# EAGLE design board_v2 (EAGLE 9.2.0)
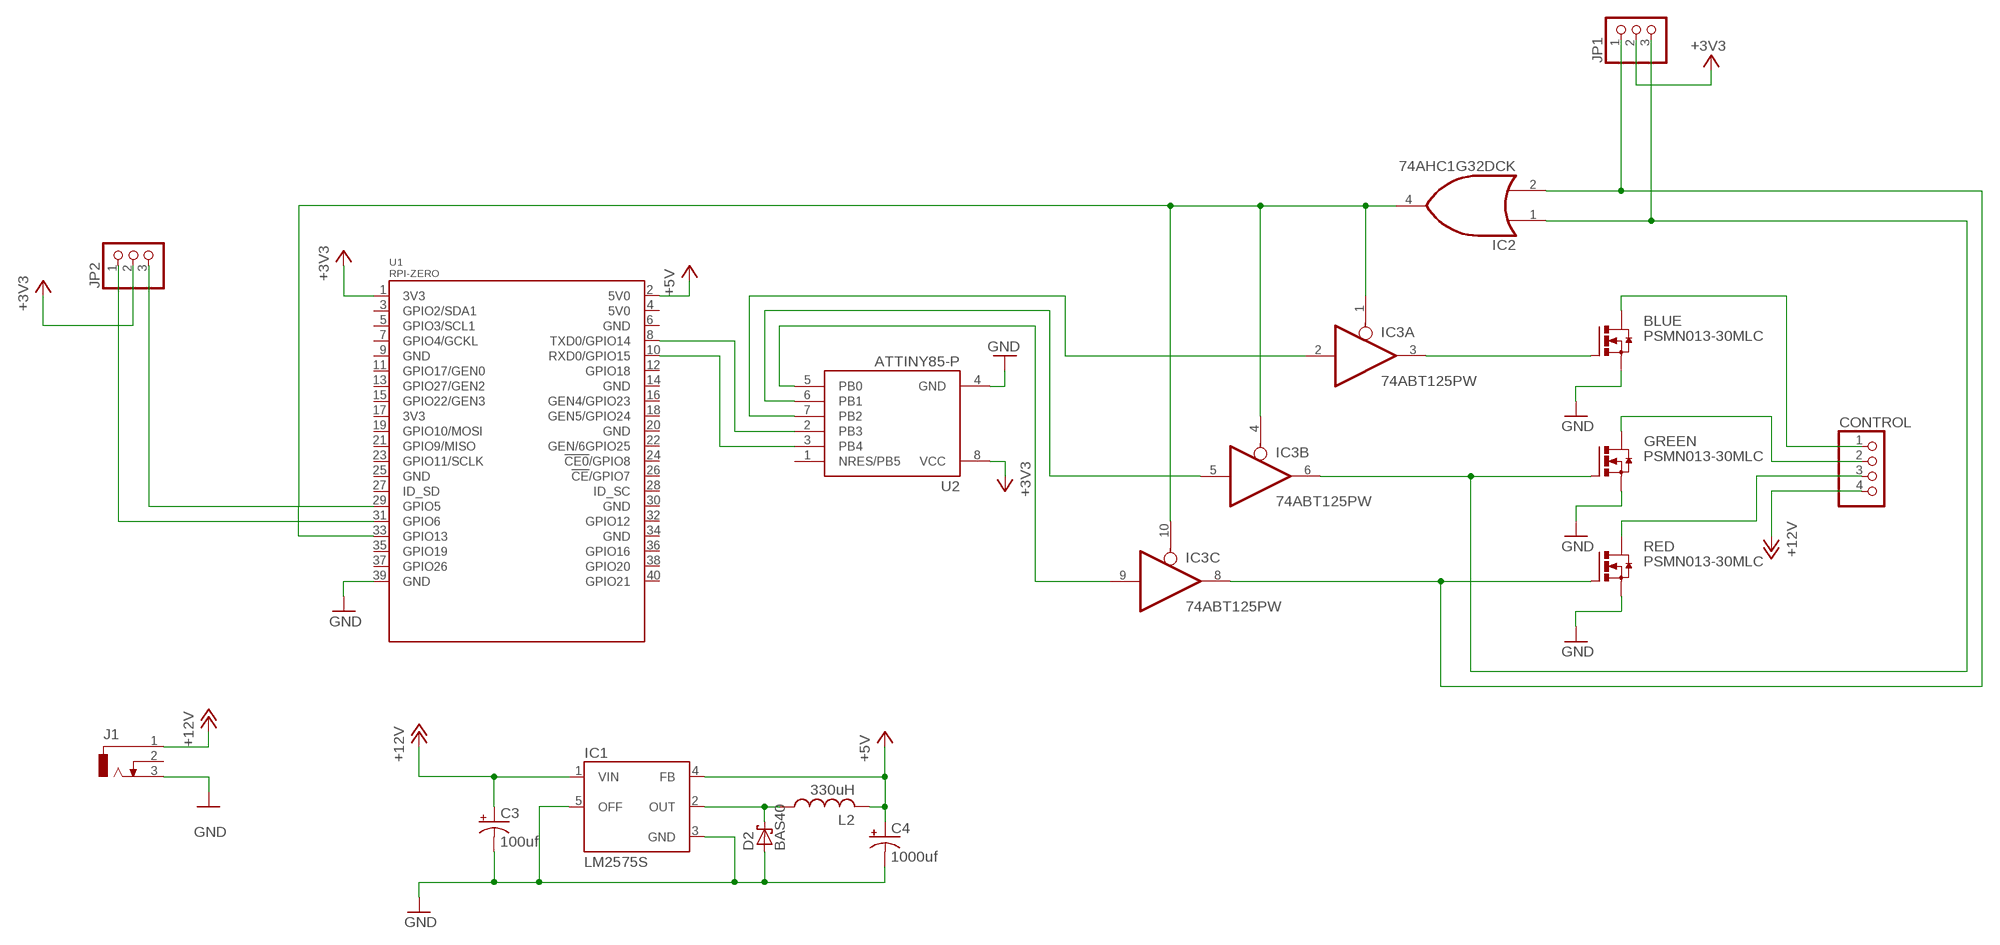
[diagram p0: schematic, sheet 1]

## Parts
BLUE  PSMN013-30MLC  [LFPAK33]
C3  100uf  CPOL-USA/3216-18R  [A/3216-18R]
C4  1000uf  CPOL-USA/3216-18R  [A/3216-18R]
CONTROL  PINHD-1X4  [1X04]
D2  BAS40  [SOT23]
GREEN  PSMN013-30MLC  [LFPAK33]
IC1  LM2575S  [TO263-5]
IC2  74AHC1G32DCK  [SC70-5]
IC3  74ABT125PW  [TSSOP14]
J1  DCJ0303  [DCJ0303]
JP1  PINHD-1X3  [1X03]
JP2  PINHD-1X3  [1X03]
L2  330uH  L-USL1812  [L1812]
RED  PSMN013-30MLC  [LFPAK33]
U1  RPI-ZERO  [RASPBERRYPI_BASTELSTUBE_V13_RASPI_BOARD_B+_FULL]
U2  ATTINY85-P  [PDIP08_300MIL]

## Nets
+3V3: JP1.2 JP2.2 U1.1(3V3) U2.8(VCC)
+5V: C4.+ IC1.4(FB) L2.2 U1.2(5V0)
+12V: C3.+ CONTROL.4 IC1.1(VIN) J1.1
BLUE: IC3.2(A:I) U2.7(PB2)
GND: BLUE.1(S) BLUE.2(S) BLUE.3(S) C3.- C4.- D2.1(A) GREEN.1(S) GREEN.2(S) GREEN.3(S) IC1.3(GND) IC1.5(OFF) J1.3 RED.1(S) RED.2(S) RED.3(S) U1.39(GND) U2.4(GND)
GREEN: IC3.5(B:I) U2.6(PB1)
N$1: BLUE.MB(D) CONTROL.1
N$2: D2.3(C) IC1.2(OUT) L2.1
N$3: CONTROL.2 GREEN.MB(D)
N$4: CONTROL.3 RED.MB(D)
N$5: IC2.2(I1) IC3.8(C:O) JP1.1 RED.4(G)
N$6: GREEN.4(G) IC2.1(I0) IC3.6(B:O) JP1.3
N$8: BLUE.4(G) IC3.3(A:O)
N$10: IC2.4(O) IC3.1(A:OE) IC3.4(B:OE) IC3.10(C:OE) U1.33(GPIO13)
N$11: JP2.3 U1.29(GPIO5)
N$12: JP2.1 U1.31(GPIO6)
RED: IC3.9(C:I) U2.5(PB0)
RX: U1.10(RXD0/GPIO15) U2.3(PB4)
TX: U1.8(TXD0/GPIO14) U2.2(PB3)
Unconnected: IC3.11(D:O) IC3.12(D:I) IC3.13(D:OE) J1.2 U1.3(GPIO2/SDA1) U1.4(5V0) U1.5(GPIO3/SCL1) U1.6(GND) U1.7(GPIO4/GCKL) U1.9(GND) U1.11(GPIO17/GEN0) U1.12(GPIO18) U1.13(GPIO27/GEN2) U1.14(GND) U1.15(GPIO22/GEN3) U1.16(GEN4/GPIO23) U1.17(3V3) U1.18(GEN5/GPIO24) U1.19(GPIO10/MOSI) U1.20(GND) U1.21(GPIO9/MISO) U1.22(GEN/6GPIO25) U1.23(GPIO11/SCLK) U1.24(!CE0!/GPIO8) U1.25(GND) U1.26(!CE!/GPIO7) U1.27(ID_SD) U1.28(ID_SC) U1.30(GND) U1.32(GPIO12) U1.34(GND) U1.35(GPIO19) U1.36(GPIO16) U1.37(GPIO26) U1.38(GPIO20) U1.40(GPIO21) U2.1(NRES/PB5)

## Power pins joined to a net without a drawn wire
GND: IC2.3(GND) IC3.7(P:GND)
VCC: IC2.5(VCC) IC3.14(P:VCC)

## Library data of the parts
BLUE GREEN RED = transistor-power:PSMN013-30MLC: N-channel 30 V 13.6 mΩ logic level MOSFET NextPower Technology Source: Data sheet <http://www.nxp.com/documents/data_sheet/PSMN013-30MLC.pdf> PSMN013-30MLC © NXP B.V. 2012. All rights reserved.; MPN: PSMN013-30MLC; OC_FARNELL: 2115260; OC_NEWARK: 05W5709
C3 C4 = rcl:CPOL-US: POLARIZED CAPACITOR, American symbol; SPICEPREFIX: C
CONTROL = pinhead:PINHD-1X4: PIN HEADER
D2 = diode:BAS40: Silicon Schottky Diodes General-purpose diode for high-speed switching
IC1 = v-reg-3:LM2575: National Semiconductor <http://www.national.com> 1.0A "Simple Switcher"(c) 52kHz, Vout 1.23-37V (HV: 57V), Vin 40V (HV: 60V), 50µA standby current
IC2 = 74xx-little-us:74*1G32: 2-input OR gate
IC3 = 74xx-us:74*125: Quad bus BUFFER, 3-state
J1 = con-jack:DCJ0303: DC POWER JACK Source: DCJ0303.pdf; OC_FARNELL: unknown; OC_NEWARK: unknown
JP1 JP2 = pinhead:PINHD-1X3: PIN HEADER
L2 = rcl:L-US: INDUCTOR, American symbol; SPICEPREFIX: L
U1 = RPI-Zero:RPI-ZERO
U2 = _hhn_attiny25_45_85:ATTINY85*: ATMEL ATtiny 85 Packages: P = PDIP 08 30mil S = SOIC 08 EIAJ 208mil Technologies Note: for complete ordering code (temp. range, finish, tape&reel etc.) see www.atmel.com • Supply Voltage: V = (1.8…5.5)V | [blank] = (2.7…5.5)V • Speed: 10 = 10 MHz | 20 = 20 MHz Author: Dipl.-Ing. FH Rainer Bayer HHN Hochschule Heilbronn (Heilbronn University), rainer.bayer@hs-heilbronn.de Ingenieurbüro ing-rb, mail@ing-rb.de

## Board
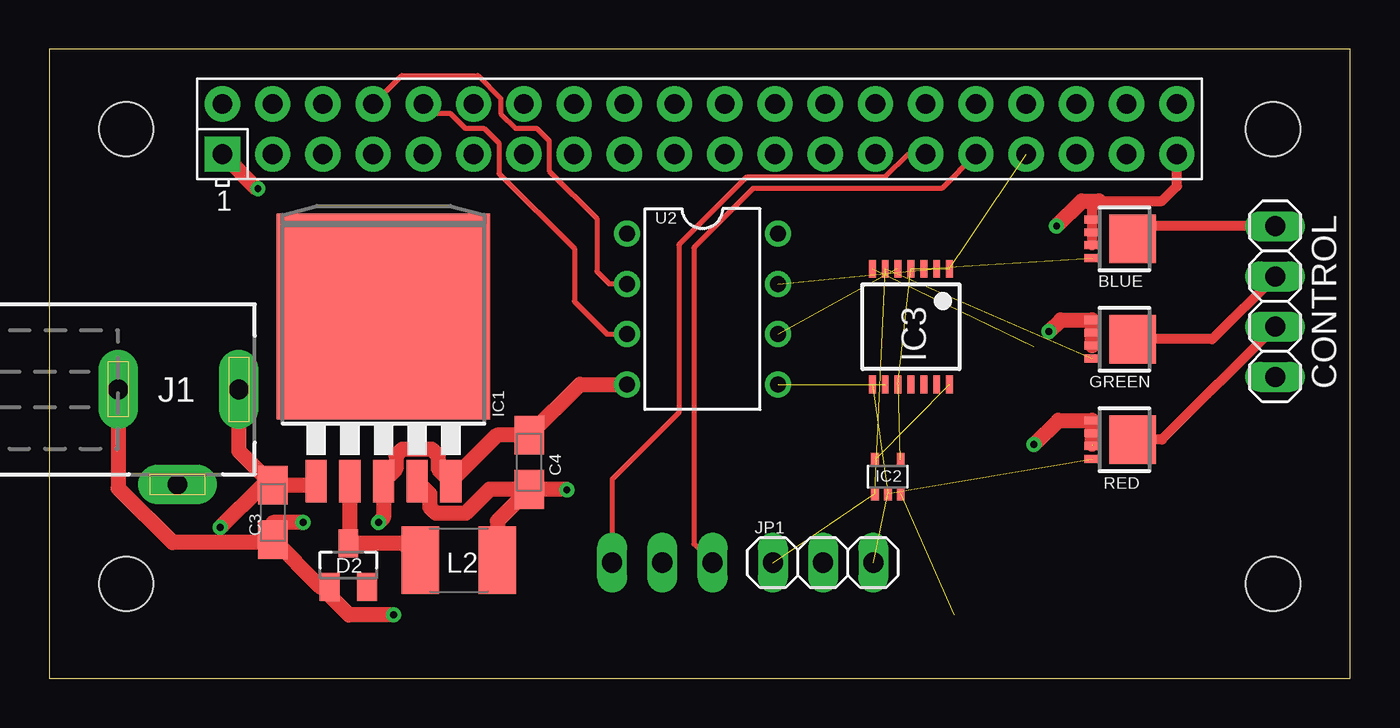
[diagram p1: board, top side]
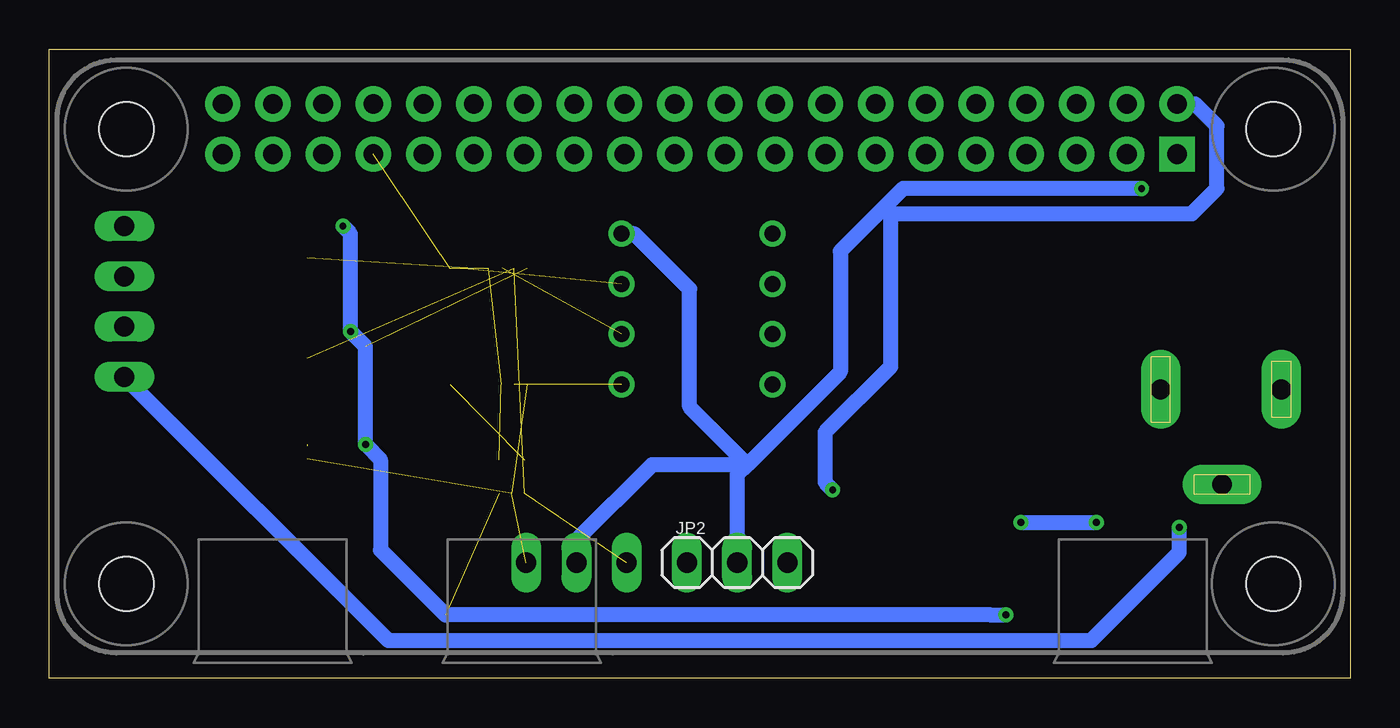
[diagram p2: board, bottom side, seen from below]

Size 65.77 x 31.8 mm. Coordinates in mm from the lower left corner, seen from the top.
Outline: 0,0 65.77,0 65.77,31.8 0,31.8 0,0
Copper layers (1*16): Top 0.035mm / dielectric 1.5mm / Bottom 0.035mm
Design rules "default": minimum track width 6mil, minimum drill 0.35mm, track to track 6mil, track to pad 6mil, pad to pad 6mil, via to via 6mil, smd to smd 6mil, copper to edge 40mil, drill to drill 6mil, minimum pad ring 10mil, minimum via ring 8mil, stop-mask expansion 4mil, vias tented up to drill 0mil, thermal gap 10mil

### Footprints (pad centres in the part's own frame; a part is rotated, then mirrored left to right if it is on the bottom)
LFPAK33 = smd 0.4 x 0.8: 1 -0.975,-1.625; 2 -0.325,-1.625; 3 0.325,-1.625; 4 0.975,-1.625 | smd 2.45 x 2.35: MB 0,0.425
A/3216-18R = smd 1.95 x 1.5: + 1.375,0; - -1.375,0
1X04 = drill 1.016 long: 1 -3.81,0; 2 -1.27,0; 3 1.27,0; 4 3.81,0
SOT23 = smd 1 x 1.4: 1 -0.95,-1.1; 2 0.95,-1.1; 3 0,1.1
TO263-5 = smd 1.067 x 2.159: 1 -3.404,-5.791; 2 -1.702,-5.791; 3 0,-5.791; 4 1.702,-5.791; 5 3.404,-5.791 | smd 10.8 x 10.41: 6 0,2.54
SC70-5 = smd 0.4 x 0.7: 1 -0.65,-0.85; 2 0,-0.85; 3 0.65,-0.85; 4 0.65,0.85; 5 -0.65,0.85
TSSOP14 = smd 0.35 x 0.9: 1 -1.95,-2.925; 2 -1.3,-2.925; 3 -0.65,-2.925; 4 0,-2.925; 5 0.65,-2.925; 6 1.3,-2.925; 7 1.95,-2.925; 8 1.95,2.925; 9 1.3,2.925; 10 0.65,2.925; 11 0,2.925; 12 -0.65,2.925; 13 -1.3,2.925; 14 -1.95,2.925
DCJ0303 = drill 1 pad 2 long: 1 0,3.1; 2 4.8,0; 3 0,-3
1X03 = drill 1.016 long: 1 -2.54,0; 2 0,0; 3 2.54,0
L1812 = smd 1.9 x 3.4: 1 -1.95,0; 2 1.95,0
RASPBERRYPI_BASTELSTUBE_V13_RASPI_BOARD_B+_FULL = drill 1 pad 1.778 square: 1 8.37,25.23 | drill 1 pad 1.778: 2 8.37,27.77; 3 10.91,25.23; 4 10.91,27.77; 5 13.45,25.23; 6 13.45,27.77; 7 15.99,25.23; 8 15.99,27.77; 9 18.53,25.23; 10 18.53,27.77; 11 21.07,25.23; 12 21.07,27.77; 13 23.61,25.23; 14 23.61,27.77; 15 26.15,25.23; 16 26.15,27.77; 17 28.69,25.23; 18 28.69,27.77; 19 31.23,25.23; 20 31.23,27.77; 21 33.77,25.23; 22 33.77,27.77; 23 36.31,25.23; 24 36.31,27.77; 25 38.85,25.23; 26 38.85,27.77; 27 41.39,25.23; 28 41.39,27.77; 29 43.93,25.23; 30 43.93,27.77; 31 46.47,25.23; 32 46.47,27.77; 33 49.01,25.23; 34 49.01,27.77; 35 51.55,25.23; 36 51.55,27.77; 37 54.09,25.23; 38 54.09,27.77; 39 56.63,25.23; 40 56.63,27.77 | hole 2.75: 3.5,3.5; 3.5,26.5; 61.5,3.5; 61.5,26.5
PDIP08_300MIL = drill 0.813: 1 -3.81,-3.81; 2 -1.27,-3.81; 3 1.27,-3.81; 4 3.81,-3.81; 5 3.81,3.81; 6 1.27,3.81; 7 -1.27,3.81; 8 -3.81,3.81

### Placement (x,y rotation side)
BLUE  54.36,22.23 270 top
C3  11.3,8.38 90 top
C4  24.26,10.92 270 top
CONTROL  61.98,19.05 270 top
D2  15.11,5.72 0 top
GREEN  54.36,17.15 270 top
IC1  16.89,15.75 0 top
IC2  42.39,10.19 0 top
IC3  43.56,17.78 180 top
J1  6.48,14.6 270 top
JP1  39.12,5.84 180 top
JP2  30.99,5.84 0 bottom
L2  20.7,5.97 0 top
RED  54.36,12.07 270 top
U1  0.38,1.27 0 top
U2  33.02,18.67 270 top

### Tracks (layer width: path | path; a pad name or v marks a point on that pad's centre or on a via)
+3V3  (via drill 0.35)
  Top 0.762: U1.1 10.49,24.77 v10.54,24.77
  Bottom 0.762: v10.54,24.77 22.61,24.77 25.78,21.59 25.78,15.49 30.48,10.79 | JP1.2 39.12,6.99 35.31,10.79 32.13,10.79 30.48,10.79 | 30.48,10.79 30.99,10.29 JP2.2 | 30.48,10.79 33.4,13.72 33.4,19.68 36.2,22.48 U2.8
+5V  (via drill 0.35)
  Top 0.762: IC1.4 19.23,9.32 19.23,8.66 19.54,8.34 21.05,8.34 22.25,9.55 C4.+ | C4.+ 22.65,7.94 L2.2 | v26.16,9.52 26.14,9.55 C4.+
  Bottom 0.762: U1.2 7.83,29.04 6.73,27.94 6.73,24.77 8,23.49 23.11,23.49 23.24,23.37 23.24,15.75 26.54,12.45 26.54,9.91 v26.16,9.52
+12V  (via drill 0.35)
  Top 0.762: C3.+ 13.29,9.76 IC1.1 | J1.1 9.58,11.48 C3.+ | v8.64,7.62 10.77,9.76 C3.+
  Bottom 0.762: CONTROL.4 48.64,1.91 13.08,1.91 8.64,6.35 v8.64,7.62
BLUE  (1 unrouted)
GND  (via drill 0.35)  (3 unrouted)
  Top 0.508: BLUE.3 BLUE.2 BLUE.1 52.73,23.77 53.09,24.13 56.26,24.13 57.01,24.88 U1.39
  Top 0.762: C3.- 11.64,7.01 11.49,6.86 6.22,6.86 3.48,9.6 J1.3 | C3.- 13.69,4.62 D2.1 14.27,4.51 14.27,4.08 15.15,3.2 v17.4,3.2 | C3.- 11.3,7.87 v12.83,7.87 | v16.64,7.87 16.89,8.13 IC1.3 17.53,10.59 17.53,11.26 17.84,11.57 19.35,11.57 19.66,11.26 19.66,10.59 IC1.5 22.63,12.3 C4.- 26.82,14.86 U2.4 | 52.73,11.82 RED.2 RED.1 51.01,13.04 v49.78,11.81 | v50.93,22.86 52.2,24.13 53.09,24.13 | v50.55,17.53 51.14,18.12 GREEN.1 GREEN.2 GREEN.3
  Bottom 0.762: v16.64,7.87 v12.83,7.87 | v17.4,3.2 18.16,3.2 45.74,3.2 49.02,6.48 49.02,11.05 v49.78,11.81 49.78,16.76 v50.55,17.53 50.55,22.48 v50.93,22.86
GREEN  (1 unrouted)
  Top 0.254: 42.89,20.73 IC3.5
N$1
  Top 0.508: BLUE.MB 55.42,22.86 CONTROL.1
N$2
  Top 0.762: IC1.2 15.19,6.89 D2.3 17.91,6.82 L2.1
N$3
  Top 0.508: CONTROL.2 58.8,17.15 GREEN.MB
N$4
  Top 0.508: CONTROL.3 56.26,12.07 RED.MB
N$5  (3 unrouted)
N$6  (3 unrouted)
N$8  (1 unrouted)
N$10  (4 unrouted)
  Top 0.254: 42.94,14.82 IC3.10
N$11
  Top 0.254: U1.29 43.42,26.5 42.26,25.33 35.24,25.33 31.83,21.92 31.83,13.44 28.45,10.06 JP2.3
N$12
  Top 0.254: U1.31 45.12,24.77 35.59,24.77 | 35.59,24.77 35.56,24.77 | 35.59,24.77 32.59,21.77 32.59,6.78 JP2.1
RED  (1 unrouted)
RX
  Top 0.254: U1.10 19.38,28.57 20.26,28.57 21.03,27.81 21.97,27.81 22.73,27.05 22.73,25.53 26.54,21.72 26.54,19.05 28.19,17.4 U2.3
TX
  Top 0.254: U1.8 17.81,30.48 21.66,30.48 22.82,29.32 22.82,28.56 23.57,27.81 24.64,27.81 25.27,27.18 25.27,25.65 27.69,23.24 27.69,20.57 28.32,19.94 U2.2
VCC  (1 unrouted)